# Altium schematic sheet LiPo_Charger.SchDoc
size Letter; Author: Lihong; Chenwei; SheetNumber: 6; SheetTotal: 8
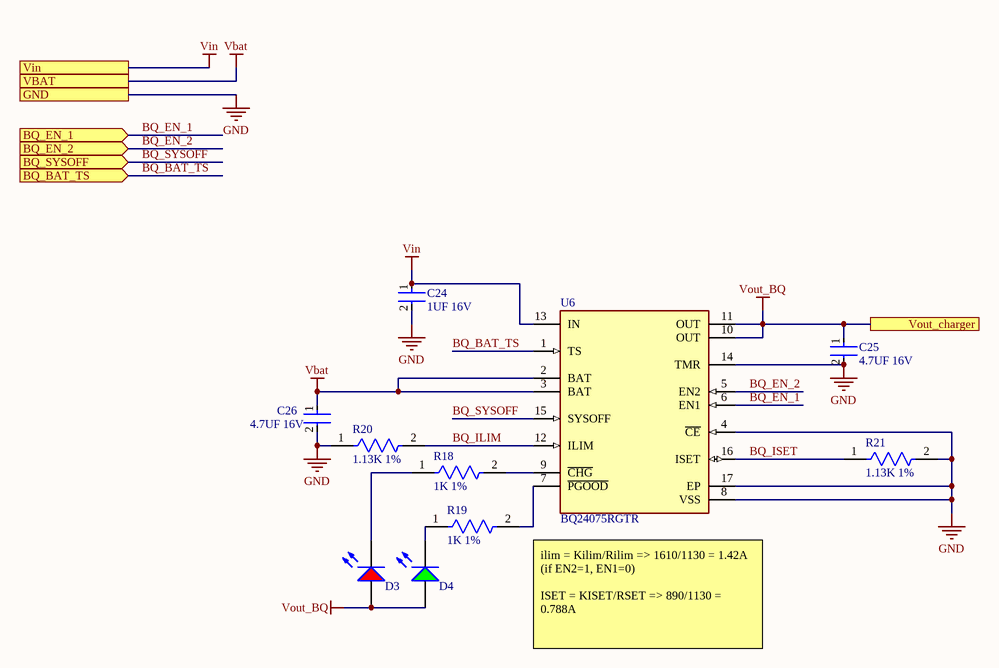
[diagram p0: LiPo_Charger.SchDoc]

## Parts
C24  1UF 16V  [FP-CC0603-DA-MFG]
C25  4.7UF 16V  [FP-CC0402-MFG]
C26  4.7UF 16V  [FP-CC0402-MFG]
D3  LSM0805412V  [LED_0805_RED]  (value not drawn)
D4  LSM0805452V  [LED_0805]  (value not drawn)
R18  1K 1%  [FP-RNCP0603-IPC_C]
R19  1K 1%  [FP-RNCP0603-IPC_C]
R20  1.13K 1%  [FP-RMCF1210-IPC_C]
R21  1.13K 1%  [FP-RMCF1210-IPC_C]
U6  BQ24075RGTR  [FP-RGT0016C-IPC_A]

## Ports
BQ_BAT_TS (in), BQ_EN_1 (in), BQ_EN_2 (in), BQ_SYSOFF (in), GND, VBAT, Vin, Vout_charger

## Nets
GND: C24.2 C25.2 C26.2 R20.1 R21.2 U6.4(~{CE}) U6.8(VSS) U6.14(TMR) U6.17(EP) ; port GND
Vbat: C26.1 U6.2(BAT) U6.3(BAT) ; port VBAT
Vin: C24.1 U6.13(IN) ; port Vin
Vout_BQ: C25.1 D3.A D4.A U6.10(OUT) U6.11(OUT) ; port Vout_charger
BQ_BAT_TS: U6.1(TS) ; port BQ_BAT_TS
BQ_EN_1: U6.6(EN1) ; port BQ_EN_1
BQ_EN_2: U6.5(EN2) ; port BQ_EN_2
BQ_ILIM: R20.2 U6.12(ILIM)
BQ_ISET: R21.1 U6.16(ISET)
BQ_SYSOFF: U6.15(SYSOFF) ; port BQ_SYSOFF
NetD3_K: D3.K R18.1
NetD4_K: D4.K R19.1
NetR18_2: R18.2 U6.9(~{CHG})
NetR19_2: R19.2 U6.7(~{PGOOD})

## Notes on the sheet
- ilim = Kilim/Rilim => 1610/1130 = 1.42A (if EN2=1, EN1=0)
  ISET = KISET/RSET => 890/1130 = 0.788A
- Title:
- Desc:
- Size:
- Letter
- Auth:
- Proj:
- Sheet
- of
- www.seas.upenn.edu
- Electrical and Systems Engineering

## Library data of the parts
C24 = CMP-03422-001047-1: CC0603 1 uF X7R 10.00% 16 V; Manufacturer: YAGEO; Manufacturer Part Number: CC0603KPX7R7BB105; Temperature Coefficient: 15%; Tolerance: 0.1; Material: Ceramic; Device Class L3: Ceramic Capacitors; Temperature Characteristic: X7R; Device Class L2: Capacitors; Temperature Range Low: -55°C; Footprint Url: http://www.yageo.com/exep/pages/download/literatures/UPY-C_GEN_24.pdf; Device Class L1: Passive Components; Temperature: -55°C to +125°C; Voltage Rating: 16 V; RoHS: TRUE; ComponentLink2URL: http://www.yageo.com/documents/recent/UPY-GPHC_X7R_6.3V-to-50V_18.pdf; Mouser Description: Cap Ceramic 1uF 16V X7R 10% SMD 0603 125°C Paper T/R; Octopart: https://octopart.com/cc0603kpx7r7bb105-yageo-25629533; Automotive: No; Capacitance: 1 uF; Height: 0.9mm; Voltage: 16 V; Lead Free: Yes; Category: Cap; Package: CC0603-DA; Temperature Range High: +125°C; Value: 1 uF; ComponentLink2Description: Datasheet
C25 C26 = CMP-03422-000634-1: CAP CER 4700PF 25V X7R 0402; Manufacturer Part Number: CC0402KRX7R8BB472; Manufacturer: YAGEO; Material: Ceramic; Automotive Grade: NA; Value: 4.7 nF; Tolerance: 0.1; Temperature Coefficient: 30ppm/°C; ComponentLink2URL: http://www.yageo.com/documents/recent/UPY-GP_NP0_16V-to-50V_16.pdf; Digikey Description: CAP CER 4700PF 25V X7R 0402; RoHS: TRUE; Ipc Land Pattern Name: CAPC10050X50; Footprint Url: http://www.yageo.com/exep/pages/download/literatures/UPY-C_GEN_24.pdf; Voltage Rating: 25 V; Mouser Description: 0402 4.7 nF 25 V ±10 % Tolerance X7R SMT Multilayer Ceramic Capacitor; Device Class L3: Ceramic Capacitors; Device Class L1: Passive Components; ComponentLink2Description: Datasheet; Temperature Range Low: -55°C; Device Class L2: Capacitors; Category: Cap; Octopart: https://octopart.com/cc0402krx7r8bb472-yageo-40254851; Lead Free: Yes; Height: 0.55mm; Temperature: -55°C to +125°C; Automotive: No; Temperature Range High: +125°C; Capacitance: 4.7 nF; Package: CC0402; Temperature Characteristic: X7R
D3 = CMP-00026-00001-1: Single Color LED, RED, 0805; Test Current: 20mA; Forward Voltage: 2V; RoHS Compliant: Yes
D4 = CMP-00038-3: Single Color LED, Green, 0805; Test Current: 20mA; Forward Voltage: 2V; RoHS Compliant: Yes
R18 R19 = CMP-26527-006179-1: 1kΩ ±1% 0.125W 0603 High Power Anti-Sulfur Thin Film Chip Resistor; Temperature Coefficient: 100ppm/°C; Max Power Dissipation: 125mW; Resistance: 1kR; Case/Package: 0603; Width: 0.031inch; Tolerance: 1%; Case Code (Imperial): 0603; RoHS Compliant: Yes; Min Operating Temperature: -55°C; Resistor Type: Thin Film; Features: Moisture Resistant; Length: 0.059inch; Mount: Surface Mount; Case Code (Metric): 1608; Height: 0.02inch; Max Operating Temperature: 155°C; Packaging: Tape and Reel; Series: RNCP; Number of Terminations: 2
R20 R21 = CMP-26527-006360-1: 1.13kΩ ±1% 0.5W 1210 Thick Film Chip Resistor AEC-Q200 compliant; Temperature Coefficient: 100ppm/°C; Resistance: 1.13kR; Max Power Dissipation: 333mW; Resistor Type: Thick Film; Height: 0.028inch; Min Operating Temperature: -55°C; Case Code (Imperial): 1210; Radiation Hardening: No; Width: 0.098inch; RoHS Compliant: Yes; Number of Terminations: 2; Case Code (Metric): 3225; Series: RMCF; Case/Package: 1210; Length: 0.126inch; Mount: Surface Mount; Contact Plating: Tin; Features: Automotive AEC-Q200; Max Operating Temperature: 155°C; Packaging: Tape and Reel; Tolerance: 1%
U6 = CMP-0321-00238-3: IC LI-ION CHARGE MGMT 16-QFN; Max Supply Voltage: 6.4V; Number of Cells: 1; Min Supply Voltage: 4.35V; Battery Chemistry: LITHIUM-ION; Max Charge Current: 1.5A; Output Voltage: 4.2V; Interface: USB; Min Input Voltage: 4.3V; Fault Protection: Over Voltage; Weight: 0.000808oz; Package Quantity: 3000; Min Operating Temperature: -40°C; Case/Package: VQFN; Lead Free: Lead Free; Number of Pins: 16; RoHS Compliant: Yes; Series: -; Packaging: Tape and Reel; Output Current: 1.5A; Contact Plating: Gold; Battery Pack Voltage: 4.2V; Max Operating Temperature: 125°C; Radiation Hardening: No